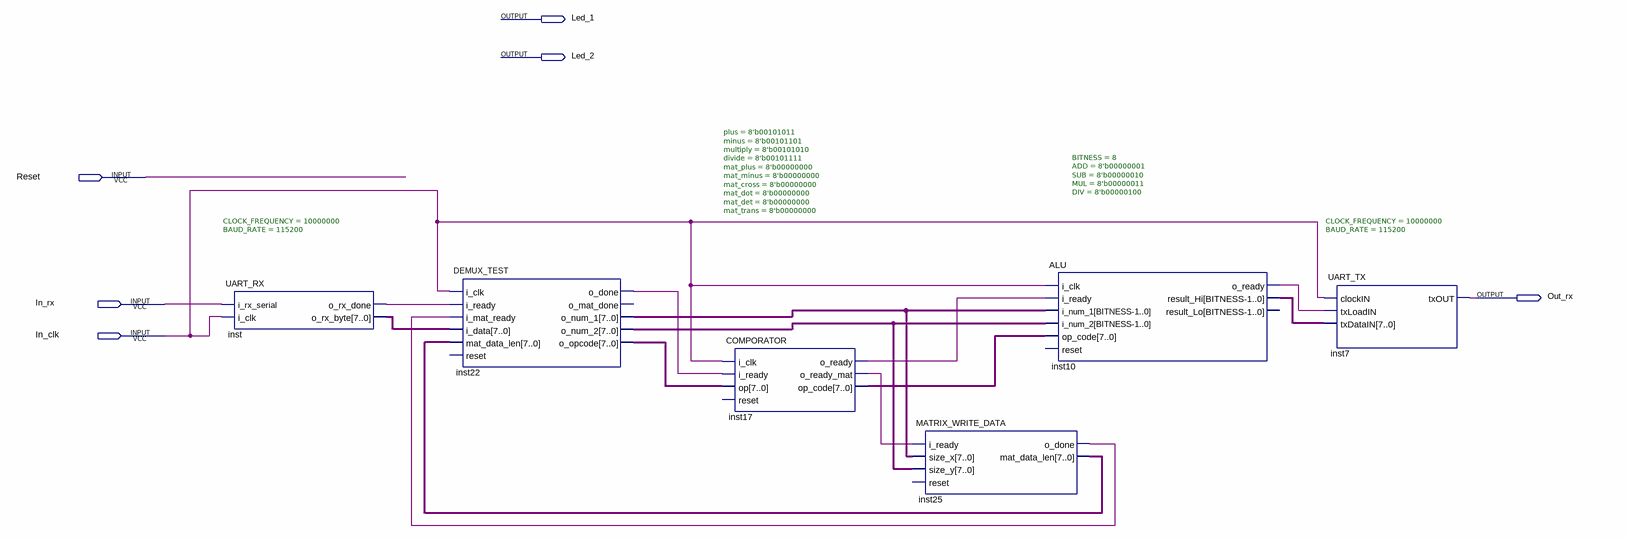
[diagram p0: schematic sheet]
// Quartus schematic Test_Scheme.bdf as structural Verilog: 6 symbols, 6 pins
module Test_Scheme (
  input  Reset,
  input  In_rx,
  input  In_clk,
  output Led_1,
  output Led_2,
  output Out_rx
);

  wire inst10_o_ready, inst17_o_ready, inst17_o_ready_mat, inst22_o_done, inst25_o_done, inst_o_rx_done;
  wire [7:0] inst10_result_hi, inst17_op_code, inst22_o_num_1, inst22_o_num_2, inst22_o_opcode,
       inst25_mat_data_len, inst_o_rx_byte;

  UART_RX #(.CLOCK_FREQUENCY(10000000), .BAUD_RATE(115200)) inst (
    .i_rx_serial(In_rx), .i_clk(In_clk), .o_rx_done(inst_o_rx_done), .o_rx_byte(inst_o_rx_byte));
  DEMUX_TEST inst22 (
    .i_clk(In_clk), .i_ready(inst_o_rx_done), .i_mat_ready(inst25_o_done), .i_data(inst_o_rx_byte),
    .mat_data_len(inst25_mat_data_len), .o_done(inst22_o_done), .o_num_1(inst22_o_num_1),
    .o_num_2(inst22_o_num_2), .o_opcode(inst22_o_opcode));  // open: reset, o_mat_done
  COMPORATOR #(.plus(8'b00101011), .minus(8'b00101101), .multiply(8'b00101010), .divide(8'b00101111), .mat_plus(8'b00000000), .mat_minus(8'b00000000), .mat_cross(8'b00000000), .mat_dot(8'b00000000), .mat_det(8'b00000000), .mat_trans(8'b00000000)) inst17 (
    .i_clk(In_clk), .i_ready(inst22_o_done), .op(inst22_o_opcode), .o_ready(inst17_o_ready),
    .o_ready_mat(inst17_o_ready_mat), .op_code(inst17_op_code));  // open: reset
  MATRIX_WRITE_DATA inst25 (
    .i_ready(inst17_o_ready_mat), .size_x(inst22_o_num_1), .size_y(inst22_o_num_2), .o_done(inst25_o_done),
    .mat_data_len(inst25_mat_data_len));  // open: reset
  ALU #(.BITNESS(8), .ADD(8'b00000001), .SUB(8'b00000010), .MUL(8'b00000011), .DIV(8'b00000100)) inst10 (
    .i_clk(In_clk), .i_ready(inst17_o_ready), .i_num_1(inst22_o_num_1), .i_num_2(inst22_o_num_2),
    .op_code(inst17_op_code), .o_ready(inst10_o_ready), .result_Hi(inst10_result_hi));  // open: reset, result_Lo
  UART_TX #(.CLOCK_FREQUENCY(10000000), .BAUD_RATE(115200)) inst7 (
    .clockIN(In_clk), .txLoadIN(inst10_o_ready), .txDataIN(inst10_result_hi), .txOUT(Out_rx));
endmodule
